# Altium schematic sheet Connecteur_Nucleo.SchDoc: Connecteur Nucleo
size A4; Author: Xavier Hueber; Engineer: Xavier Hueber; Organization: Altium Limited; Address1: Laboratoire de Systèmes Embarqués; Address2: 7, rue de la Serre; Address3: 2610 Saint-Imier / Switzerland; DocumentNumber: 2; Revision: 1; SheetNumber: 2; SheetTotal: 4
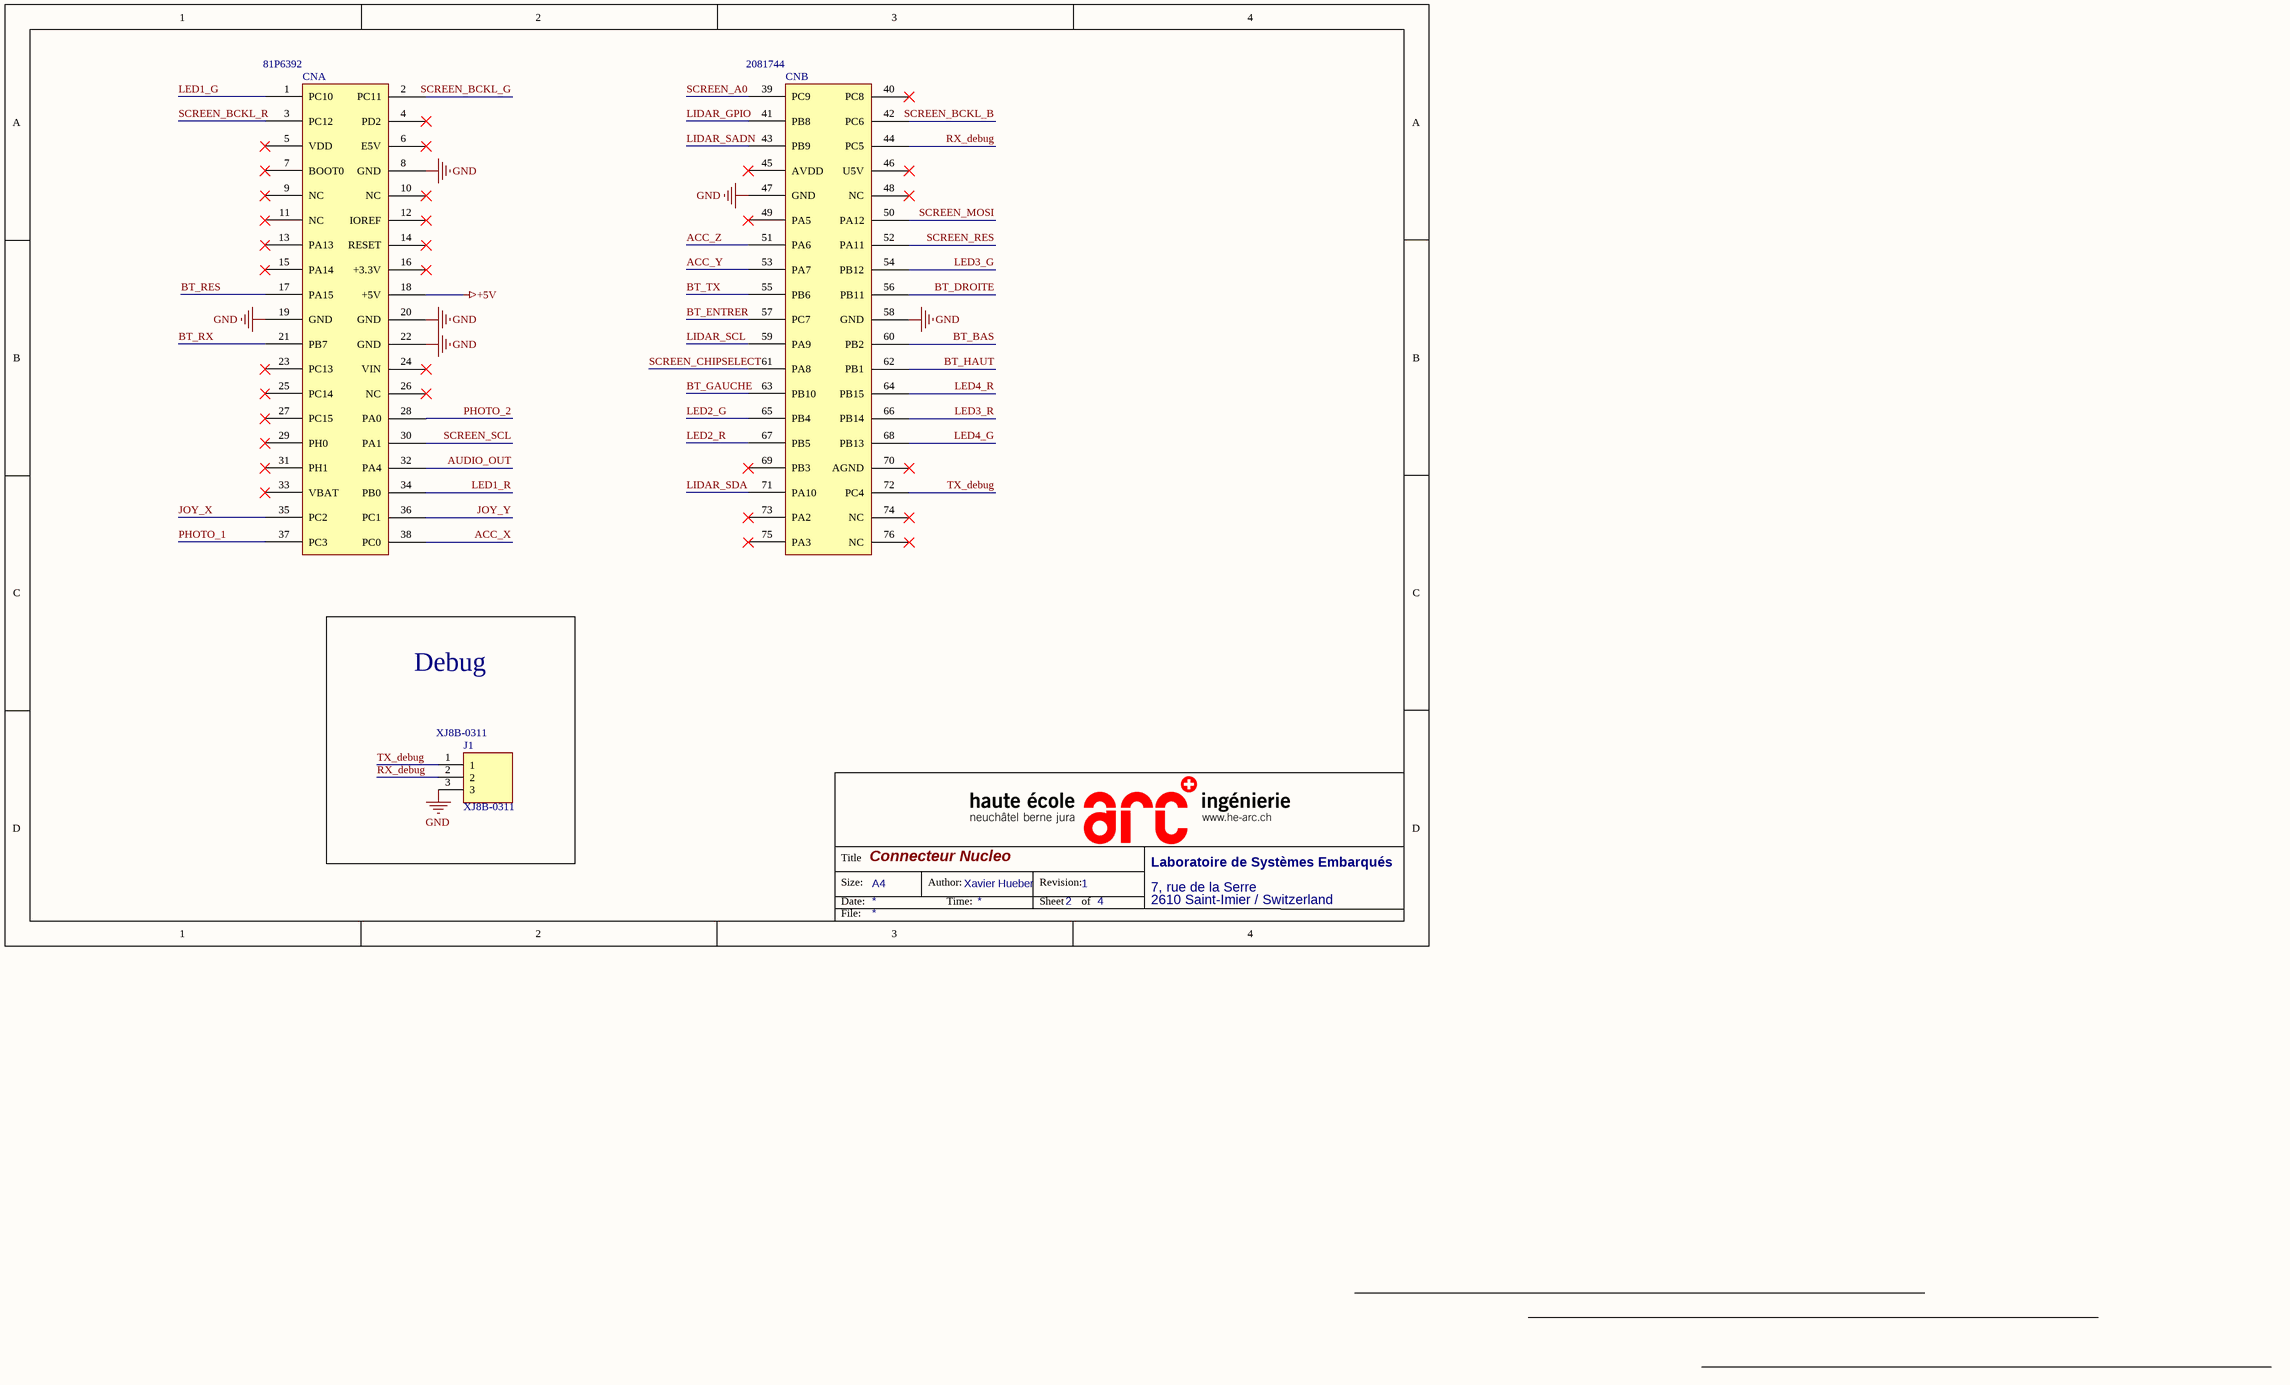
[diagram p0: Connecteur_Nucleo.SchDoc]

## Parts
CN  Supplier Part Number 1: 81P6392  [Nucleo-conn-SMD - sans 3D]  (parts A,B of 2)
J1  XJ8B-0311  [HDRV3W64P0X254_1X3_760X250X580P]

## Blocks framed on the sheet
Debug: J1

## Nets
+5V: CN.18(+5V)
GND: CN.8(GND) CN.19(GND) CN.20(GND) CN.22(GND) CN.47(GND) CN.58(GND) J1.3
ACC_X: CN.38(PC0)
ACC_Y: CN.53(PA7)
ACC_Z: CN.51(PA6)
AUDIO_OUT: CN.32(PA4)
BT_BAS: CN.60(PB2)
BT_DROITE: CN.56(PB11)
BT_ENTRER: CN.57(PC7)
BT_GAUCHE: CN.63(PB10)
BT_HAUT: CN.62(PB1)
BT_RES: CN.17(PA15)
BT_RX: CN.21(PB7)
BT_TX: CN.55(PB6)
JOY_X: CN.35(PC2)
JOY_Y: CN.36(PC1)
LED1_G: CN.1(PC10)
LED1_R: CN.34(PB0)
LED2_G: CN.65(PB4)
LED2_R: CN.67(PB5)
LED3_G: CN.54(PB12)
LED3_R: CN.66(PB14)
LED4_G: CN.68(PB13)
LED4_R: CN.64(PB15)
LIDAR_GPIO: CN.41(PB8)
LIDAR_SADN: CN.43(PB9)
LIDAR_SCL: CN.59(PA9)
LIDAR_SDA: CN.71(PA10)
PHOTO_1: CN.37(PC3)
PHOTO_2: CN.28(PA0)
RX_debug: CN.44(PC5) J1.2
SCREEN_A0: CN.39(PC9)
SCREEN_BCKL_B: CN.42(PC6)
SCREEN_BCKL_G: CN.2(PC11)
SCREEN_BCKL_R: CN.3(PC12)
SCREEN_CHIPSELECT: CN.61(PA8)
SCREEN_MOSI: CN.50(PA12)
SCREEN_RES: CN.52(PA11)
SCREEN_SCL: CN.30(PA1)
TX_debug: CN.72(PC4) J1.1

Not connected (* = marked no-connect by the designer): CN 4(PD2)* 5(VDD)* 6(E5V)* 7(BOOT0)* 9(NC)* 10(NC)* 11(NC)* 12(IOREF)* 13(PA13)* 14(RESET)* 15(PA14)* 16(+3.3V)* 23(PC13)* 24(VIN)* 25(PC14)* 26(NC)* 27(PC15)* 29(PH0)* 31(PH1)* 33(VBAT)* 40(PC8)* 45(AVDD)* 46(U5V)* 48(NC)* 49(PA5)* 69(PB3)* 70(AGND)* 73(PA2)* 74(NC)* 75(PA3)* 76(NC)*

## Notes on the sheet
- Title
- Size:
- Date:
- A4
- Author:
- Time:
- Revision:
- Sheet
- of
- File:

## Library data of the parts
CN = CN1: Headers & Wire Housings Surface Mount PCB Socket Strips, 0.100 pitch; Supplier 1: Newark
J1 = XJ8B-0311: Conn Unshrouded Header PL 3 POS 2.54mm Solder ST Top Entry Thru-Hole; Manufacturer_Name: Omron Electronics; Datasheet Link: https://www.omron.com/ecb/products/pdf/en-xj8.pdf; Height: 5.8mm; Manufacturer_Part_Number: XJ8B-0311; Supplier 1: Arrow Electronics; Supplier Part Number 1: XJ8B-0311